# EasyEDA schematic SCH_RP2350_Ucompute2_Rev1.1_2025-11-06.json
TITLE: uCompute RP2350 (USB-C); REV: 1.1; Date: 2025-11-05; Sheet: 1/1; Drawn By: greatjp; Company: Your Company
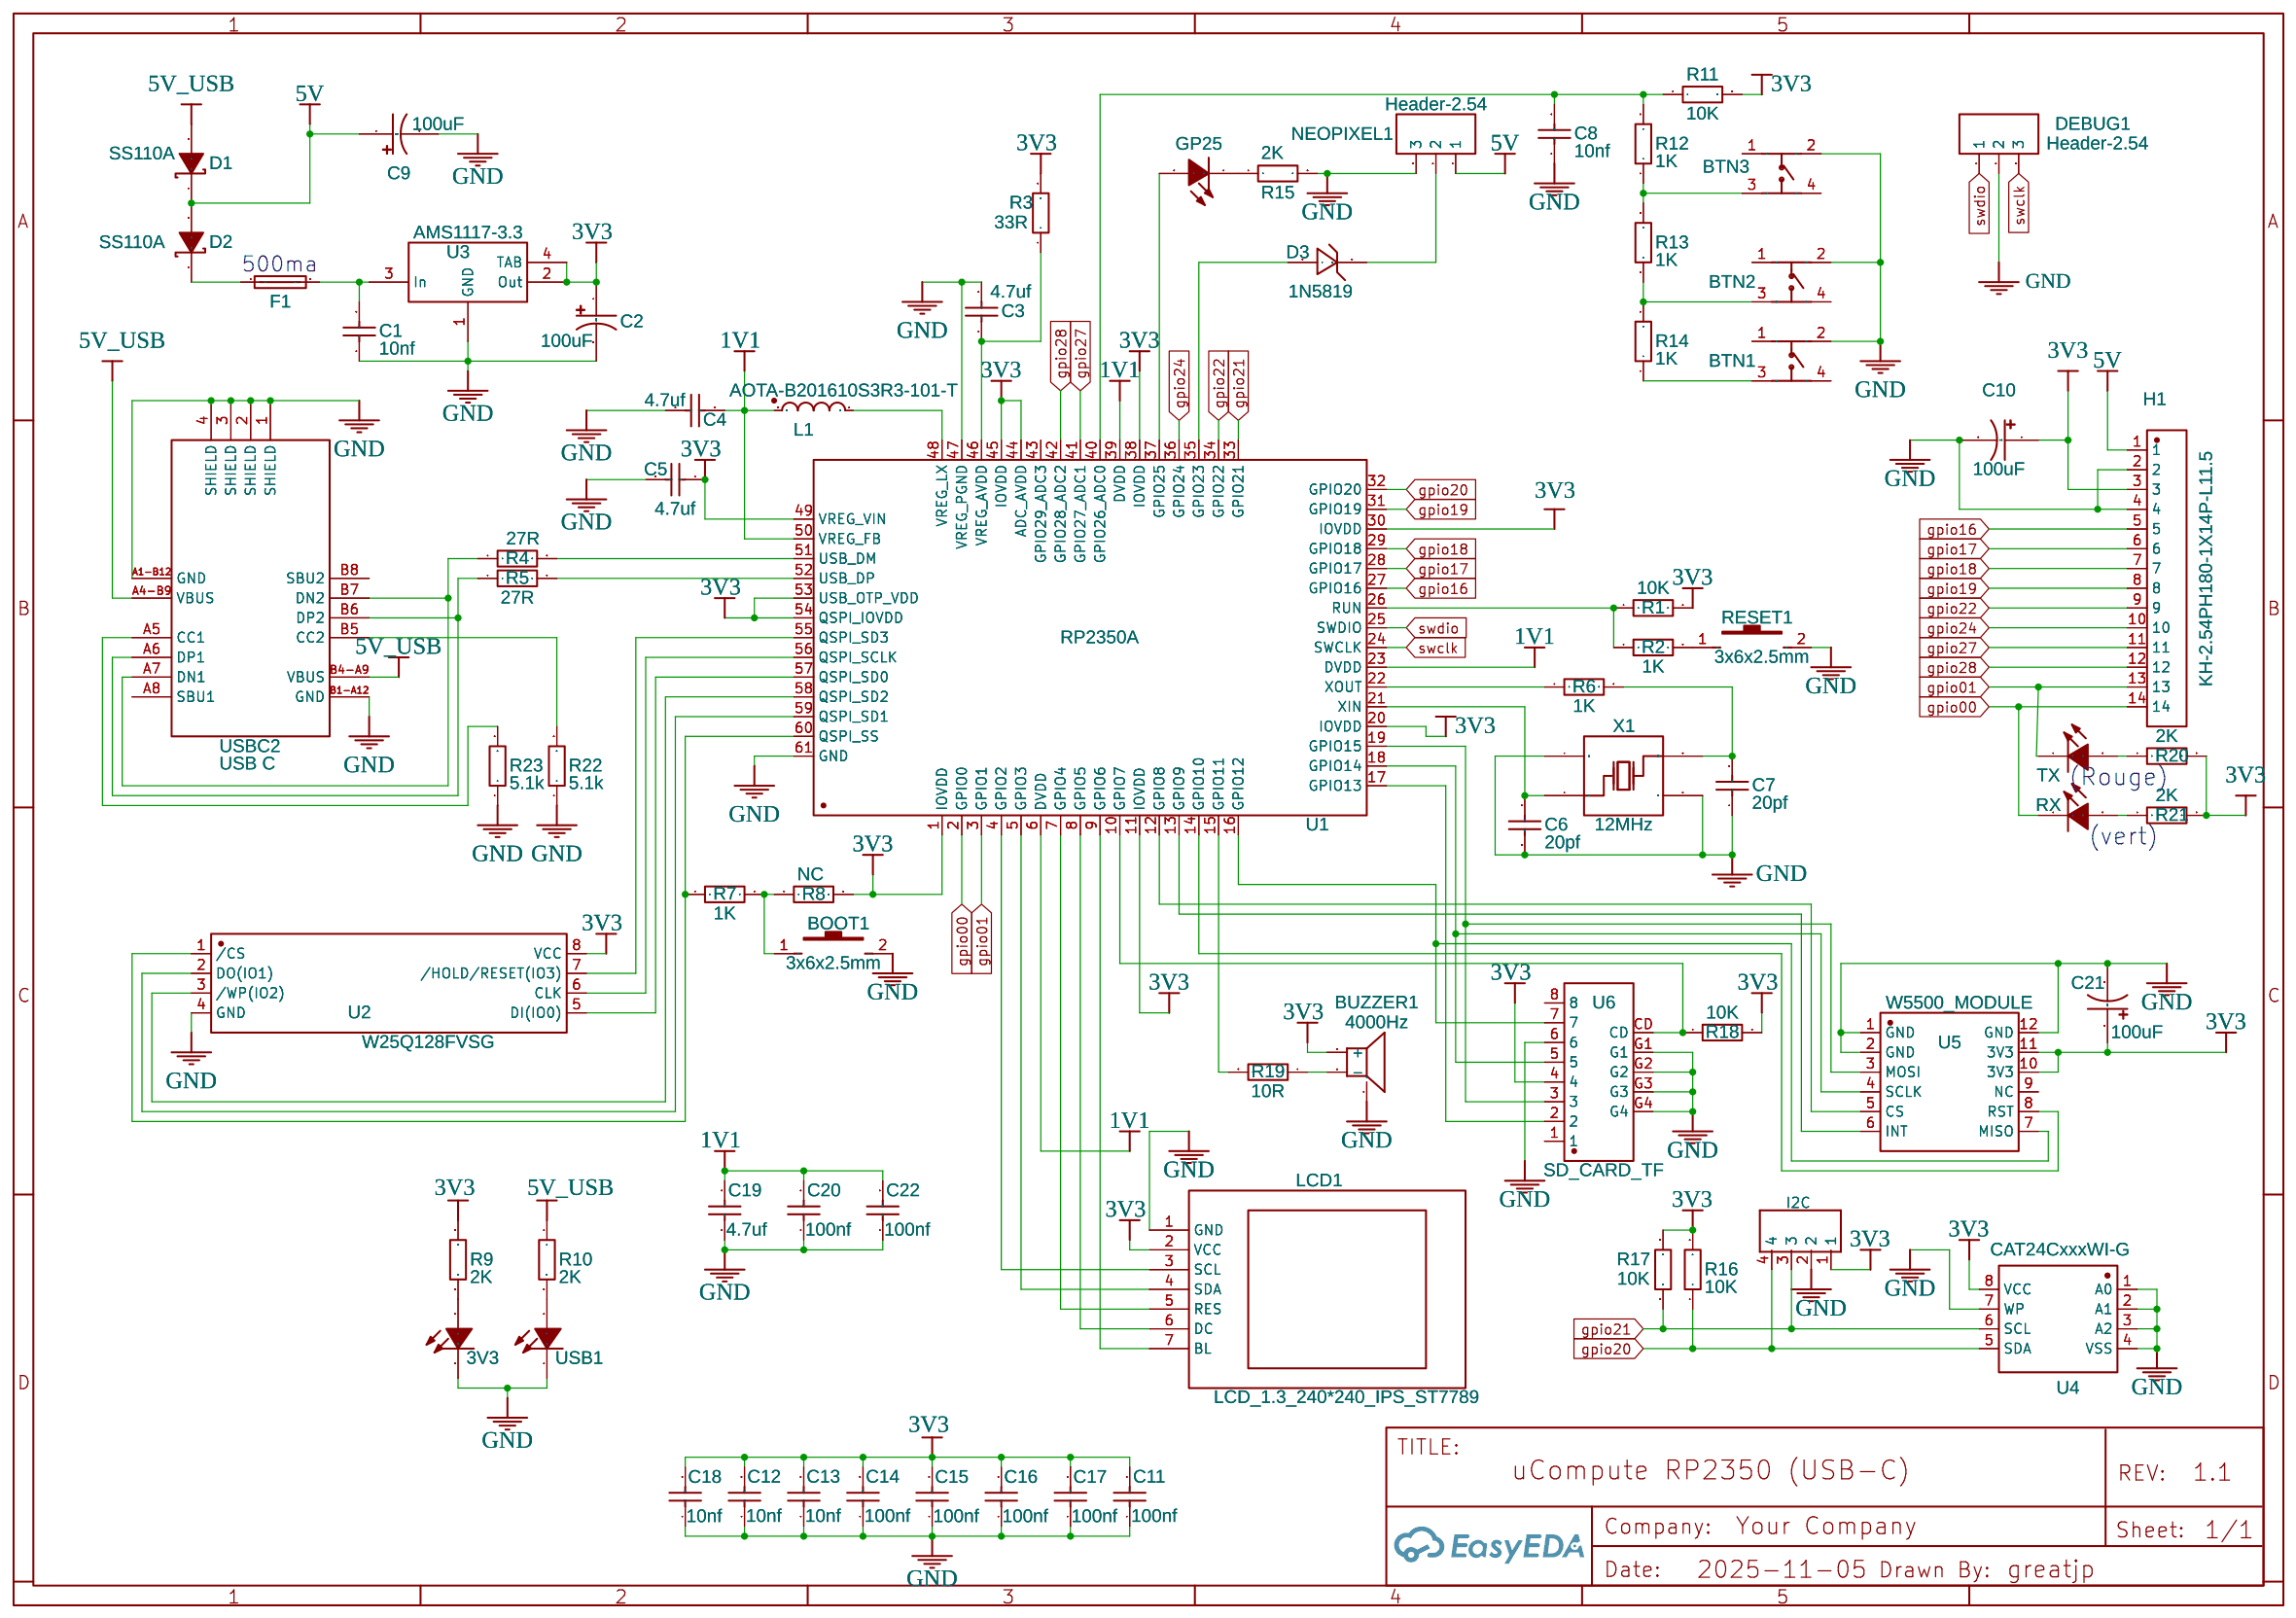
[diagram p0: schematic sheet]

## Parts
3V3  XL-1206QPC  [LED0805-RD_GREEN]
BOOT1  3x6x2.5mm  [SW-SMD_L6.0-W3.6-LS8.0]
BTN1  TC-1102-A-J-R  [SW-TH_4P-L6.0-W6.0-P4.50-LS6.5]
BTN2  TC-1102-A-J-R  [SW-TH_4P-L6.0-W6.0-P4.50-LS6.5]
BTN3  TC-1102-A-J-R  [SW-TH_4P-L6.0-W6.0-P4.50-LS6.5]
BUZZER1  4000Hz  [BUZ-SMD_3P-L5.2-W5.2-P3.50-BR]
C1  10nf  [C0603]
C2  100uF  [CASE-B_3528]
C3  4.7uf  [C0603]
C4  4.7uf  [C0603]
C5  4.7uf  [C0603]
C6  20pf  [C0603]
C7  20pf  [C0603]
C8  10nf  [C0603]
C9  100uF  [CASE-B_3528]
C10  100uF  [CASE-B_3528]
C11  100nf  [C0603]
C12  10nf  [C0603]
C13  10nf  [C0603]
C14  100nf  [C0603]
C15  100nf  [C0603]
C16  100nf  [C0603]
C17  100nf  [C0603]
C18  10nf  [C0603]
C19  4.7uf  [C0603]
C20  100nf  [C0603]
C21  100uF  [CASE-B_3528]
C22  100nf  [C0603]
D1  SS110A  [DO-214AC_L4.3-W2.7-LS5.3-RD]
D2  SS110A  [DO-214AC_L4.3-W2.7-LS5.3-RD]
D3  1N5819  [SOD-123_L2.7-W1.6-LS3.7-RD-1]
DEBUG1  Header-2.54  [HDR-TH_3P-P2.54-V-M-1]
F1  FUSE1206  [F1206]
GP25  XL-1206QPC  [LED0805-RD_BLUE]
H1  KH-2.54PH180-1X14P-L11.5  [HDR-TH_14P-P2.54-V-M]
I2C  I2C  [CONN-XH2.54-4PIN]
L1  AOTA-B201610S3R3-101-T  [IND-SMD_L2.0-W1.6_AOTA-B201610S3R3-101-T]
LCD1  LCD_1.3_240*240_IPS_ST7789  [LCD_1.3_240*240_IPS_ST7789]
NEOPIXEL1  Header-2.54  [HDR-TH_3P-P2.54-V-M-1]
R1  10K  [R0603]
R2  1K  [R0603]
R3  33R  [R0603]
R4  27R  [R0603]
R5  27R  [R0603]
R6  1K  [R0603]
R7  1K  [R0603]
R8  NC  [R0603]
R9  2K  [R0603]
R10  2K  [R0603]
R11  10K  [R0603]
R12  1K  [R0603]
R13  1K  [R0603]
R14  1K  [R0603]
R15  2K  [R0603]
R16  10K  [R0603]
R17  10K  [R0603]
R18  10K  [R0603]
R19  10R  [R0805]
R20  2K  [R0603]
R21  2K  [R0603]
R22  5.1k  [R0603]
R23  5.1k  [R0603]
RESET1  3x6x2.5mm  [SW-SMD_L6.0-W3.6-LS8.0]
RX1  RX  [LED0805-RD_BLUE]
TX1  TX  [LED0805-RD_BLUE]
U1  RP2350A  [QFN-60_L7.0-W7.0-P0.40-TL-EP3.4]
U2  W25Q128FVSG  [SOIC-8_L5.2-W5.2-P1.27-LS7.9-BL]
U3  AMS1117-3.3  [SOT-223_L6.5-W3.5-P2.30-LS7.0-BR]
U4  CAT24CxxxWI-G  [SOIC-8]
U5  W5500_MODULE  [COMM-TH_L25.0-W23.0_W5500_MODULE]
U6  SD_CARD_TF  [MICRO-USB-SMD_MICRO-SD]
USB1  XL-1206QPC  [LED0805-RD_BLUE]
USBC2  USB C  [USB-C-SMD_MC-311D]
X1  12MHz  [OSC-SMD_4P-L3.2-W2.5-BL]

## Library data of the parts
3V3 GP25 RX1 TX1 USB1 = XL-1206QPC: Supplier: LCSC; Manufacturer: LCSC; Supplier Part: C10781; JLCPCB Part Class: Extended Part; Package Display: No
BOOT1 RESET1 = 3x6x2.5mm: Supplier Part: C5382; Supplier: LCSC; Manufacturer: ReliaPro; JLCPCB Part Class: Extended Part
BTN1-BTN3 = TC-1102-A-J-R: Supplier: LCSC; Supplier Part: C2885243; Manufacturer: XKB Connectivity(中国星坤); Contributor: LCSC; JLCPCB Part Class: Extended Part
BUZZER1 = MLT-5030: Supplier: LCSC; Manufacturer: 华能; Supplier Part: C95297; JLCPCB Part Class: Extended Part
C1 C3-C8 C11-C20 C22 = 0805CG220J500NT: Supplier: LCSC; Manufacturer: FH; Supplier Part: C38143; JLCPCB Part Class: Extended Part
C2 C9 C10 C21 = TLJA107M010R1400: Supplier: LCSC; Supplier Part: C313517; Manufacturer: Kyocera AVX; Contributor: LCSC; JLCPCB Part Class: Extended Part; Package Display: No
D1 D2 = SS110A: Supplier: LCSC; Supplier Part: C211767; Manufacturer: Yangzhou Yangjie Elec Tech; Contributor: LCSC; JLCPCB Part Class: Extended Part
D3 = 1N4148D: Contributor: lcsc; Supplier: LCSC; Supplier Part: C9900023634; Manufacturer: null; JLCPCB Part Class: Extended Part
DEBUG1 NEOPIXEL1 = Header-Male-2.54_1x3: Supplier: LCSC; Manufacturer: BOOMELE(博穆精密); Manufacturer Part: 2.54-1*3P针; Supplier Part: C49257; JLCPCB Part Class: Extended Part
F1 = D22051903536_FUSE1206: Supplier: LCSC; Supplier Part: C9900019275; Manufacturer: null; Manufacturer Part: D22051903536_fuse1206; JLCPCB Part Class: Extended Part; Contributor: lcsc
H1 = KH-2.54PH180-1X14P-L11.5: Contributor: LCSC; Supplier: LCSC; Supplier Part: C2905490; Manufacturer: kinghelm(金航标); JLCPCB Part Class: Extended Part
L1 = AOTA-B201610S3R3-101-T: Supplier: LCSC; Supplier Part: C42411119; Manufacturer: ABRACON; JLCPCB Part Class: Extended Part; Contributor: lcsc
LCD1 = LCD_1.3_240*240_IPS_ST7789: Contributor: puzrin
R1-R23 = RC0805DR-071KL: Supplier: LCSC; Manufacturer: YAGEO(国巨); Contributor: LCSC; Supplier Part: C100051; JLCPCB Part Class: Extended Part; Resistance: 1kΩ
U1 = RP2350A_C42411118: Supplier: LCSC; Supplier Part: C42411118; Manufacturer: Raspberry Pi(树莓派); Contributor: lcsc; JLCPCB Part Class: Extended Part
U2 = W25Q128FVSG: Supplier: LCSC; Supplier Part: C9900022211; Manufacturer: null; JLCPCB Part Class: Extended Part; Contributor: lcsc
U3 = AMS1117-5.0_C165483: Supplier: LCSC; Supplier Part: C165483; Manufacturer: SK; Manufacturer Part: AMS1117-5.0; Contributor: LCSC; JLCPCB Part Class: Extended Part
U4 = CAT24C256WI-G
U5 = W5500_MODULE: Supplier: LCSC; Supplier Part: C9900160625; Manufacturer: null
U6 = SD_CARD_TF: Supplier: LCSC; Supplier Part: C9900016722; Manufacturer: null; Manufacturer Part: SD_Card_TF; Contributor: lcsc; JLCPCB Part Class: Extended Part
USBC2 = USB C: Supplier: LCSC; Supplier Part: C136423; Manufacturer: SOFNG; Manufacturer Part: MC-311D; Contributor: La Ode Muhamad Idris
X1 = TSX-3225 12MHz 20pF 30ppm: Supplier: LCSC; Manufacturer: EPSON; Supplier Part: C91751; JLCPCB Part Class: Extended Part

## Nets
1V1: C4.1 C19.2 C20.2 C22.2 L1.2 U1.6(DVDD) U1.23(DVDD) U1.39(DVDD) U1.50(VREG_FB)
3V3: BUZZER1.2(+) C2.1 C5.1 C10.1 C11.2 C12.2 C13.2 C14.2 C15.2 C16.2 C17.2 C18.2 C21.1 H1.3 I2C.1 LCD1.2(VCC) R1.2 R3.2 R8.2 R9.2 R11.2 R16.2 R17.2 R18.2 R20.2 R21.2 U1.1(IOVDD) U1.11(IOVDD) U1.20(IOVDD) U1.30(IOVDD) U1.38(IOVDD) U1.44(ADC_AVDD) U1.45(IOVDD) U1.49(VREG_VIN) U1.53(USB_OTP_VDD) U1.54(QSPI_IOVDD) U2.8(VCC) U3.2(Out) U3.4(TAB) U4.8(VCC) U5.10(3V3) U5.11(3V3) U6.4
5V: C9.1 D1.2(A) D2.1(K) H1.1 NEOPIXEL1.1
5V_USB: D2.2(A) R10.1 USBC2.A4-B9(VBUS) USBC2.B4-A9(VBUS)
GND: 3V3.1(K) BOOT1.2 BTN1.2 BTN2.2 BTN3.2 BUZZER1.1(NC) C1.1 C2.2 C3.2 C4.2 C5.2 C6.1 C7.1 C8.1 C9.2 C10.2 C11.1 C12.1 C13.1 C14.1 C15.1 C16.1 C17.1 C18.1 C19.1 C20.1 C21.2 C22.1 DEBUG1.2 H1.2 H1.4 I2C.2 LCD1.1(GND) NEOPIXEL1.3 R15.2 R22.1 R23.1 RESET1.2 U1.47(VREG_PGND) U1.61(GND) U2.4(GND) U3.1(GND) U4.1(A0) U4.2(A1) U4.3(A2) U4.4(VSS) U4.7(WP) U5.1(GND) U5.2(GND) U5.12(GND) U6.6 U6.G1 U6.G2 U6.G3 U6.G4 USB1.1(K) USBC2.1(SHIELD) USBC2.2(SHIELD) USBC2.3(SHIELD) USBC2.4(SHIELD) USBC2.A1-B12(GND) USBC2.B1-A12(GND) X1.2(NC) X1.4(NC)
gpio00: H1.14 RX1.1(K) U1.2(GPIO0)
gpio01: H1.13 TX1.1(K) U1.3(GPIO1)
gpio16: H1.5 U1.27(GPIO16)
gpio17: H1.6 U1.28(GPIO17)
gpio18: H1.7 U1.29(GPIO18)
gpio19: H1.8 U1.31(GPIO19)
gpio20: I2C.4 R16.1 U1.32(GPIO20) U4.5(SDA)
gpio21: I2C.3 R17.1 U1.33(GPIO21) U4.6(SCL)
gpio22: H1.9 U1.34(GPIO22)
gpio24: H1.10 U1.36(GPIO24)
gpio27: H1.11 U1.41(GPIO27_ADC1)
gpio28: H1.12 U1.42(GPIO28_ADC2)
swclk: DEBUG1.3 U1.24(SWCLK)
swdio: DEBUG1.1 U1.25(SWDIO)
Net-(3V3-2): 3V3.2(A) R9.1
Net-(BOOT1-1): BOOT1.1 R7.2 R8.1
Net-(BTN1-3): BTN1.3 R14.1
Net-(BTN2-3): BTN2.3 R13.1 R14.2
Net-(BTN3-3): BTN3.3 R12.1 R13.2
Net-(BUZZER1-3): BUZZER1.3(-) R19.1
Net-(C1-2): C1.2 F1.2 U3.3(In)
Net-(C3-1): C3.1 R3.1 U1.46(VREG_AVDD)
Net-(C6-2): C6.2 U1.21(XIN) X1.1(OSC1)
Net-(C7-2): C7.2 R6.2 X1.3(OSC2)
Net-(C8-2): C8.2 R11.1 R12.2 U1.40(GPIO26_ADC0)
Net-(D1-1): D1.1(K) F1.1
Net-(D3-1): D3.1(C) NEOPIXEL1.2
Net-(D3-2): D3.2(A) U1.35(GPIO23)
Net-(GP25-1): GP25.1(K) R15.1
Net-(GP25-2): GP25.2(A) U1.37(GPIO25)
Net-(L1-1): L1.1 U1.48(VREG_LX)
Net-(LCD1-3): LCD1.3(SCL) U1.4(GPIO2)
Net-(LCD1-4): LCD1.4(SDA) U1.5(GPIO3)
Net-(LCD1-5): LCD1.5(RES) U1.7(GPIO4)
Net-(LCD1-6): LCD1.6(DC) U1.8(GPIO5)
Net-(LCD1-7): LCD1.7(BL) U1.9(GPIO6)
Net-(R1-1): R1.1 R2.1 U1.26(RUN)
Net-(R2-2): R2.2 RESET1.1
Net-(R4-1): R4.1 USBC2.A7(DN1) USBC2.B7(DN2)
Net-(R4-2): R4.2 U1.51(USB_DM)
Net-(R5-1): R5.1 USBC2.A6(DP1) USBC2.B6(DP2)
Net-(R5-2): R5.2 U1.52(USB_DP)
Net-(R6-1): R6.1 U1.22(XOUT)
Net-(R7-1): R7.1 U1.60(QSPI_SS) U2.1(/CS)
Net-(R10-2): R10.2 USB1.2(A)
Net-(R18-1): R18.1 U1.10(GPIO7) U6.CD
Net-(R19-2): R19.2 U1.15(GPIO11)
Net-(R20-1): R20.1 TX1.2(A)
Net-(R21-1): R21.1 RX1.2(A)
Net-(R22-2): R22.2 USBC2.B5(CC2)
Net-(R23-2): R23.2 USBC2.A5(CC1)
Net-(U1-12): U1.12(GPIO8) U5.5(CS)
Net-(U1-13): U1.13(GPIO9) U5.6(INT)
Net-(U1-14): U1.14(GPIO10) U5.8(RST)
Net-(U1-16): U1.16(GPIO12) U5.7(MISO) U6.7
Net-(U1-17): U1.17(GPIO13) U6.2
Net-(U1-18): U1.18(GPIO14) U5.4(SCLK) U6.5
Net-(U1-19): U1.19(GPIO15) U5.3(MOSI) U6.3
Net-(U1-55): U1.55(QSPI_SD3) U2.7(/HOLD/RESET(IO3))
Net-(U1-56): U1.56(QSPI_SCLK) U2.6(CLK)
Net-(U1-57): U1.57(QSPI_SD0) U2.5(DI(IO0))
Net-(U1-58): U1.58(QSPI_SD2) U2.3(/WP(IO2))
Net-(U1-59): U1.59(QSPI_SD1) U2.2(DO(IO1))

Not connected (* = marked no-connect by the designer): BTN1 1 4; BTN2 1 4; BTN3 1 4; U1 43(GPIO29_ADC3); U5 9(NC); U6 1 8; USBC2 A8(SBU1) B8(SBU2)

## Notes on the sheet
- 500ma
- (Rouge)
- (vert)
